# Altium project CB3-ECB.PrjPcb (part 1 of 3)
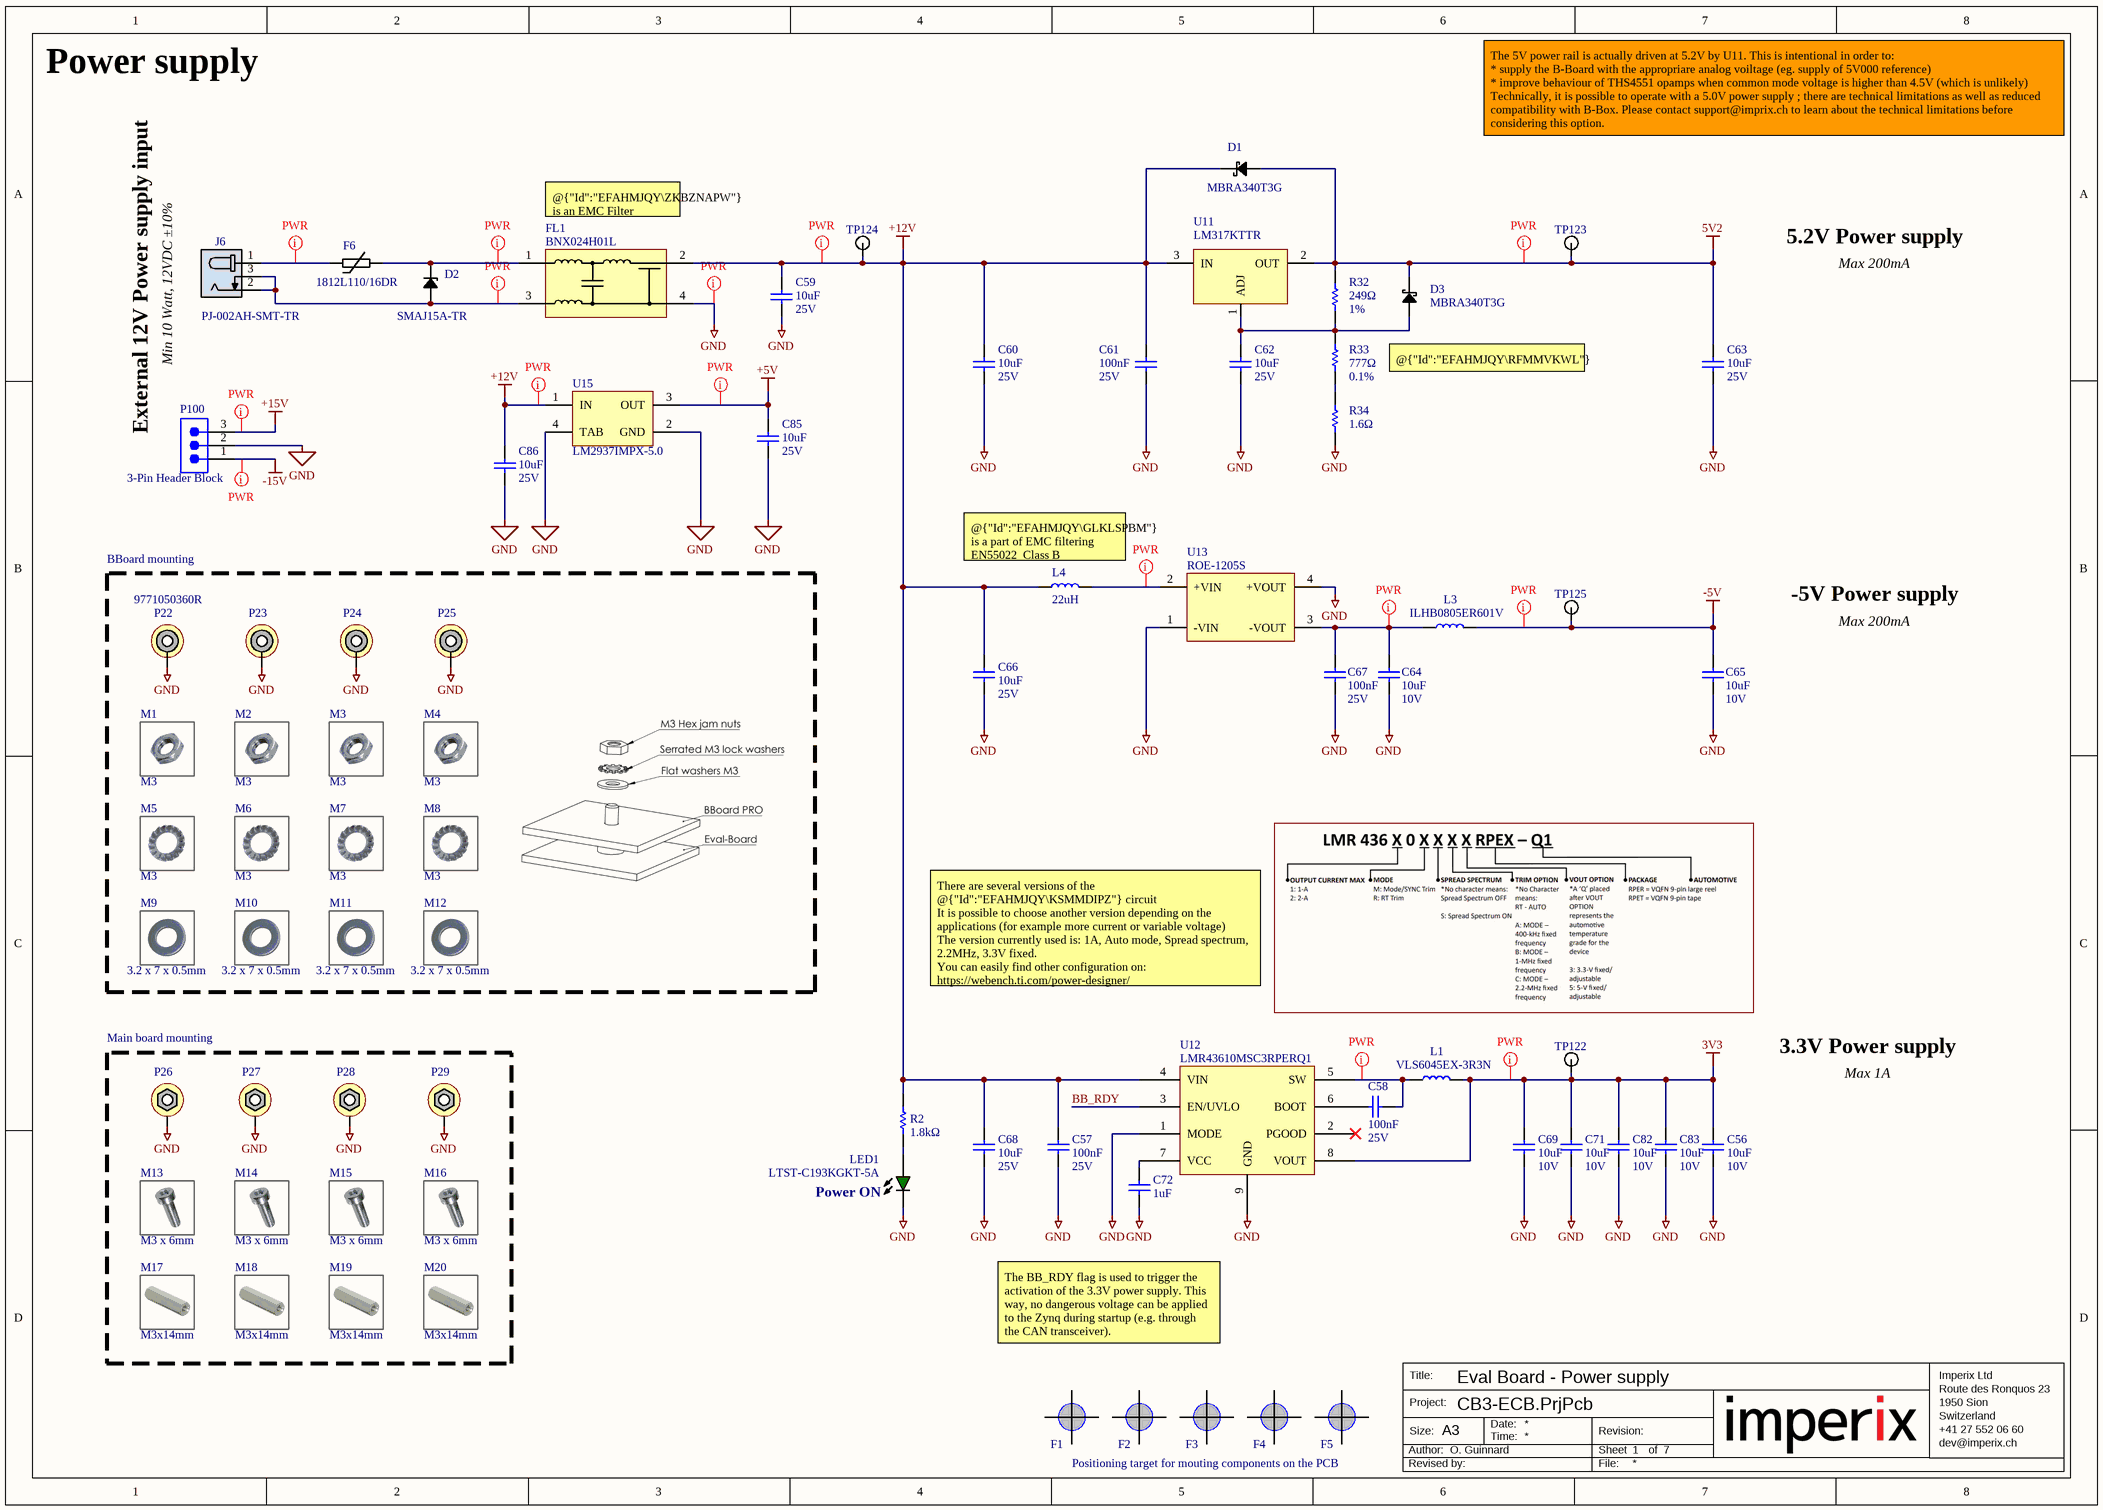
[diagram p0: Power.SchDoc]
ApprovedName: Nicolas Cherix; RevisionLetter: C; RevisionNumber: 1
6 sheets, 372 parts. Net scope: global (net labels, ports and power ports of the same name join across sheets).
Board files: CB3-ECB_PCB.PcbDoc, CB3_ECB_PCB_Pannelized.PcbDoc
Sheets:
  Power.SchDoc
  DAC.SchDoc
  ADC.SchDoc
  BBoard-JX1.SchDoc
  BBoard-JX2.SchDoc
  Test points.SchDoc

## Sheet Power.SchDoc: Eval Board - Power supply
size A3; ApprovedBy: Nicolas Cherix; Author: O. Guinnard; Organization: imperix Ltd; Address1: Rue de l'Industrie 10; Address2: 1950 Sion; Address3: Switzerland; Address4: +41 27 552 06 60; DocumentNumber: 1; Revision: C1; SheetNumber: 1; SheetTotal: 7

### Parts
C56  value 10uF  Voltage Rating (DC): 10V  [CAPC1608L(0603)]  (hidden comment: CAP-10UF-10V-X5R-0603-10%)
C57  value 100nF  Voltage Rating (DC): 25V  [CAPC1005L(0402)]  (hidden comment: CAP-100NF-25V-X7R-0402-10%)
C58  value 100nF  Voltage Rating (DC): 25V  [CAPC1005L(0402)]  (hidden comment: CAP-100NF-25V-X7R-0402-10%)
C59  value 10uF  Voltage Rating (DC): 25V  [CAPC3216L(1206)]  (hidden comment: CAP-10UF-25V-X5R-1206-10%)
C60  value 10uF  Voltage Rating (DC): 25V  [CAPC3216L(1206)]  (hidden comment: CAP-10UF-25V-X5R-1206-10%)
C61  value 100nF  Voltage Rating (DC): 25V  [CAPC1005L(0402)]  (hidden comment: CAP-100NF-25V-X7R-0402-10%)
C62  value 10uF  Voltage Rating (DC): 25V  [CAPC3216L(1206)]  (hidden comment: CAP-10UF-25V-X5R-1206-10%)
C63  value 10uF  Voltage Rating (DC): 25V  [CAPC3216L(1206)]  (hidden comment: CAP-10UF-25V-X5R-1206-10%)
C64  value 10uF  Voltage Rating (DC): 10V  [CAPC1608L(0603)]  (hidden comment: CAP-10UF-10V-X5R-0603-10%)
C65  value 10uF  Voltage Rating (DC): 10V  [CAPC1608L(0603)]  (hidden comment: CAP-10UF-10V-X5R-0603-10%)
C66  value 10uF  Voltage Rating (DC): 25V  [CAPC3216L(1206)]  (hidden comment: CAP-10UF-25V-X5R-1206-10%)
C67  value 100nF  Voltage Rating (DC): 25V  [CAPC1005L(0402)]  (hidden comment: CAP-100NF-25V-X7R-0402-10%)
C68  value 10uF  Voltage Rating (DC): 25V  [CAPC3216L(1206)]  (hidden comment: CAP-10UF-25V-X5R-1206-10%)
C69  value 10uF  Voltage Rating (DC): 10V  [CAPC1608L(0603)]  (hidden comment: CAP-10UF-10V-X5R-0603-10%)
C71  value 10uF  Voltage Rating (DC): 10V  [CAPC1608L(0603)]  (hidden comment: CAP-10UF-10V-X5R-0603-10%)
C72  value 1uF  [CAPC1005L(0402)]  (hidden comment: CAP-1UF-6.3V-X5R-0402-5%)
C82  value 10uF  Voltage Rating (DC): 10V  [CAPC1608L(0603)]  (hidden comment: CAP-10UF-10V-X5R-0603-10%)
C83  value 10uF  Voltage Rating (DC): 10V  [CAPC1608L(0603)]  (hidden comment: CAP-10UF-10V-X5R-0603-10%)
C85  value 10uF  Voltage Rating (DC): 25V  [CAPC3216L(1206)]  (hidden comment: CAP-10UF-25V-X5R-1206-10%)
C86  value 10uF  Voltage Rating (DC): 25V  [CAPC3216L(1206)]  (hidden comment: CAP-10UF-25V-X5R-1206-10%)
D1  MBRA340T3G  [DO-214AC]
D2  SMAJ15A-TR  [DO-214AC]
D3  MBRA340T3G  [DO-214AC]
F1  Fiducial  [Fiducial050]  (value not drawn)  (no BOM)
F2  Fiducial  [Fiducial050]  (value not drawn)  (no BOM)
F3  Fiducial  [Fiducial050]  (value not drawn)  (no BOM)
F4  Fiducial  [Fiducial050]  (value not drawn)  (no BOM)
F5  Fiducial  [Fiducial050]  (value not drawn)  (no BOM)
F6  1812L110/16DR  [PTC Fuse(1812)]
FL1  BNX024H01L  [FP-BNX02-MFG]
J6  PJ-002AH-SMT-TR  [PJ-002AH-SMT-TR]
L1  VLS6045EX-3R3N  [VLS6045EX]
L3  ILHB0805ER601V  [RESC2012L(0805)]
L4  value 22uH  [Inductor 8400 Serie]  (hidden comment: 84223C)
LED1  LTST-C193KGKT-5A  [LED0603_GREEN]
M1  value M3  (hidden comment: 1090615)  (mechanical)
M2  value M3  (hidden comment: 1090615)  (mechanical)
M3  value M3  (hidden comment: 1090615)  (mechanical)
M4  value M3  (hidden comment: 1090615)  (mechanical)
M5  value M3  (hidden comment: 1278037)  (mechanical)
M6  value M3  (hidden comment: 1278037)  (mechanical)
M7  value M3  (hidden comment: 1278037)  (mechanical)
M8  value M3  (hidden comment: 1278037)  (mechanical)
M9  value 3.2 x 7 x 0.5mm  (hidden comment: 1887467)  (mechanical)
M10  value 3.2 x 7 x 0.5mm  (hidden comment: 1887467)  (mechanical)
M11  value 3.2 x 7 x 0.5mm  (hidden comment: 1887467)  (mechanical)
M12  value 3.2 x 7 x 0.5mm  (hidden comment: 1887467)  (mechanical)
M13  value M3 x 6mm  (hidden comment: 1145924)  (mechanical)
M14  value M3 x 6mm  (hidden comment: 1145924)  (mechanical)
M15  value M3 x 6mm  (hidden comment: 1145924)  (mechanical)
M16  value M3 x 6mm  (hidden comment: 1145924)  (mechanical)
M17  value M3x14mm  (hidden comment: 1382748)  (mechanical)
M18  value M3x14mm  (hidden comment: 1382748)  (mechanical)
M19  value M3x14mm  (hidden comment: 1382748)  (mechanical)
M20  value M3x14mm  (hidden comment: 1382748)  (mechanical)
P22  9771050360R  [9771050360R]
P23  9771050360R  [9771050360R]  (value not drawn)
P24  9771050360R  [9771050360R]  (value not drawn)
P25  9771050360R  [9771050360R]  (value not drawn)
P26  Spacer M3 connected  [Spacer M3 connected]  (value not drawn)  (no BOM)
P27  Spacer M3 connected  [Spacer M3 connected]  (value not drawn)  (no BOM)
P28  Spacer M3 connected  [Spacer M3 connected]  (value not drawn)  (no BOM)
P29  Spacer M3 connected  [Spacer M3 connected]  (value not drawn)  (no BOM)
P100  3-Pin Header Block  [691322310003]
R2  value 1.8kΩ  [RESC1608L(0603)]  (hidden comment: RES-1.8KΩ-1/8W-25PPM-0603-0.1%)
R32  value 249Ω  Tolerance: 1%  [RESC1005L(0402)]  (hidden comment: RES-249Ω-1/16W-100PPM-0402-1%)
R33  value 777Ω  Tolerance: 0.1%  [RESC1005L(0402)]  (hidden comment: RES-777Ω-1/16W-25PPM-0402-0.1%)
R34  value 1.6Ω  [RESC1005L(0402)]  (hidden comment: RES-1.6Ω-1/16WW-200PPM-0402-5%)
TP122  5001  [5001]  (value not drawn)
TP123  5001  [5001]  (value not drawn)
TP124  5001  [5001]  (value not drawn)
TP125  5001  [5001]  (value not drawn)
U11  LM317KTTR  [TO263-3]
U12  LMR43610MSC3RPERQ1  [LMR43610MSC3RPERQ1]
U13  ROE-1205S  [ROE]
U15  LM2937IMPX-5.0  [MP04A_M]

### Blocks framed on the sheet
BBoard mounting: M1-M12 P22-P25
Main board mounting: M13-M20 P26-P29

### Nets
3V3: C56.2 C69.2 C71.2 C82.2 C83.2 L1.2 TP122.1(TP) U12.8(VOUT)
5V2: C63.2 D1.A D3.K R32.2 TP123.1(TP) U11.2(OUT)
+5V: C85.2 U15.3(OUT)
+12V: C57.2 C59.2 C60.2 C61.2 C66.2 C68.2 C86.2 D1.K FL1.2(CB) L4.1 R2.2 TP124.1(TP) U11.3(IN) U12.4(VIN) U15.1(IN)
+15V: P100.3
-5V: C65.1 L3.2 TP125.1(TP)
-15V: P100.1
GND: C56.1 C57.1 C59.1 C60.1 C61.1 C62.1 C63.1 C64.2 C65.2 C66.1 C67.2 C68.1 C69.1 C71.1 C72.1 C82.1 C83.1 C85.1 C86.1 FL1.4(CG) LED1.K P22.0 P23.0 P24.0 P25.0 P26.1 P27.1 P28.1 P29.1 P100.2 R34.1 U12.1(MODE) U12.9(GND) U13.1(-VIN) U13.4(+VOUT) U15.2(GND) U15.4(TAB)
BB_RDY: U12.3(EN/UVLO)
NetC58_1: C58.1 L1.1 U12.5(SW)
NetC58_2: C58.2 U12.6(BOOT)
NetC62_2: C62.2 D3.A R32.1 R33.2 U11.1(ADJ)
NetC64_1: C64.1 C67.1 L3.1 U13.3(-VOUT)
NetC72_2: C72.2 U12.7(VCC)
NetD2_A: D2.A FL1.3(PSG) J6.2 J6.3
NetD2_K: D2.K F6.2 FL1.1(B)
NetF6_1: F6.1 J6.1
NetL4_2: L4.2 U13.2(+VIN)
NetLED1_A: LED1.A R2.1
NetR33_1: R33.1 R34.2

Not connected (* = marked no-connect by the designer): U12 2(PGOOD)*

### Layout directives
net class PWR: 3V3, 5V2, +5V, +12V, +15V, -5V, -15V, GND, NetC58_1, NetC64_1, NetD2_A, NetD2_K, NetF6_1, NetL4_2

### Notes on the sheet
- Power supply
- The 5V power rail is actually driven at 5.2V by U11. This is intentional in order to:
  * supply the B-Board with the appropriare analog voiltage (eg. supply of 5V000 reference)
  * improve behaviour of THS4551 opamps when common mode voltage is higher than 4.5V (which is unlikely)
  Technically, it is possible to operate with a 5.0V power supply ; there are technical limitations as well as reduced compatibility with B-Box. Please contact support@imprix.ch to learn about the technical limitations before considering this option.
- (near FL1) @{"Id":"EFAHMJQY\ZKBZNAPW"} is an EMC Filter
- 5.2V Power supply
- External 12V Power supply input
- Min 10 Watt, 12VDC ±10%
- Max 200mA
- @{"Id":"EFAHMJQY\RFMMVKWL"} helps reduce the noise of @{"Id":"EFAHMJQY\SLPSMMLY"}
- (near L4) @{"Id":"EFAHMJQY\GLKLSPBM"} is a part of EMC filtering
  EN55022  Class B
- -5V Power supply
- There are several versions of the @{"Id":"EFAHMJQY\KSMMDIPZ"} circuit
  It is possible to choose another version depending on the applications (for example more current or variable voltage)
  The version currently used is: 1A, Auto mode, Spread spectrum, 2.2MHz, 3.3V fixed.
  You can easily find other configuration on: https://webench.ti.com/power-designer/
- 3.3V Power supply
- Max 1A
- (near LED1) Power ON
- The BB_RDY flag is used to trigger the activation of the 3.3V power supply. This way, no dangerous voltage can be applied to the Zynq during startup (e.g. through the CAN transceiver).
- Positioning target for mouting components on the PCB
- Title:
- Imperix Ltd
- Route des Ronquos 23
- Author:
- Project:
- Size:
- A3
- Date:
- Time:
- Revision:
- Sheet
- of
- 1950 Sion
- Switzerland
- +41 27 552 06 60
- dev@imperix.ch
- Revised by:
- File:

### Library data of the parts
C56 C64 C65 C69 C71 C82 C83 = CMP-055-000003-7: CAP CER 10UF 10V X5R 0603 10% (Generic Imperix Component); Tolerance: 10%; Dielectric: X5R; Case/Package: 0603
C57 C58 C61 C67 = CMP-004-000006-18: CAP CER 100NF 25V X7R 0402 10% (Generic Imperix Component); Tolerance: 10%; Case/Package: 0402; Dielectric: X7R
C59 C60 C62 C63 C66 C68 C85 C86 = CMP-002-000022-5: CAP CER 10UF 25V X5R 1206 10% (Generic Imperix Component); Tolerance: 10%; Dielectric: X5R; Case/Package: 1206
  C86: Manufacturer: *
C72 = CMP-004-000008-13: CAP CER 1UF 6.3V X5R 0402 5% (Generic Imperix Component); Tolerance: 5%; Case/Package: 0402; Dielectric: X5R; Voltage Rating (DC): 6.3V
D1 D3 = CMP-005-000028-6: Diode Schottky 40 V 3A Surface Mount SMA; Max Forward Surge Current (Ifsm): 100A; Max Repetitive Reverse Voltage (Vrrm): 40V; Polarity: Standard; Element Configuration: Single; Forward Voltage: 450mV; Max Reverse Current: 300uA; Max Operating Temperature: 150°C; Radiation Hardening: No; Length: 4.32mm; Reach SVHC Compliant: No; Pins: 2; Package Quantity: 1; Voltage Rating (DC): 40V; RoHS Compliant: Yes; Halogen Free: Halogen Free; Series: -; Current Rating: 3A; Case/Package: DO-214AC; Height: 2mm; Min Operating Temperature: -55°C; Lead Free: Lead Free; Peak Non-Repetitive Surge Current: 100A; Max Reverse Voltage (DC): 40V; Output Current: 3A; Width: 2.6mm; Packaging: Tape and Reel; Forward Current: 3A; Average Rectified Current: 3A
D2 = CMP-030-000001-20: 32.5V Clamp 71A (8/20µs) Ipp Tvs Diode Surface Mount SMA (DO-214AC) Unidirectional; Voltage Rating (DC): 15V; Leakage Current: 200nA; Max Breakdown Voltage: 17.6V; Value: 975pF; Min Breakdown Voltage: 16.7V; Number of Elements: 1; Diode Type: ZENER; Power Line Protection: No; Power Dissipation: 400W; ESD Protection: Yes; Test Current: 1mA; Min Operating Temperature: -55°C; Height: 2.03mm; Max Reverse Leakage Current: 200nA; Breakdown Voltage: 17.6V; Max Operating Temperature: 150°C; Clamping Voltage-Max: 32.5V; Lead Free: Lead Free; Clamping Voltage: 32.5V; Polarity: Unidirectional; Reach SVHC Compliant: No; Width: 4.6mm; RoHS Compliant: Yes; Radiation Hardening: No; Case/Package: DO-214AC; Mounting Technology: Surface Mount; Direction: Unidirectional; Pins: 2; Package Quantity: 1; Peak Pulse Power: 400W; Series: SMAJ, TRANSIL™; Reverse Breakdown Voltage: 16.7V; Reverse Standoff Voltage: 15V; Operating Supply Voltage: 15V; Length: 2.95mm; Max Surge Current: 1mA; Packaging: Tape and Reel; Peak Pulse Current: 71A; Number of Unidirectional Channels: 1; Termination: SMD/SMT
F1-F5 = CMP-031-000000-13: Fiducial for pick&place (No BOM)
F6 = CMP-00170-3: PTC Resettable Fuse 1.1A(hold)  1.95A(trip) 16VDC 1812; Max Voltage Rating (DC): 16V; Approvals: cULus,TUV; Value: 180mR; Max Power Dissipation: 800mW; Max Current Rating: 100A; Time to Trip: 300ms; Hold Current: 1.1A; Width: 4.73mm; Max Operating Temperature: 85°C; Trip Current: 1.95A; Case Code (Metric): 4532; Mounting Technology: Surface Mount; Packaging: Tape and Reel; Case Code (Imperial): 1812; RoHS Compliant: Yes; Case/Package: 1812; Series: 1812L; Power Dissipation: 800mW; Package Quantity: 1500; Current Rating: 100A; Lead Free: Lead Free; Termination: SMD/SMT; Operating Supply Voltage: 16V; Min Operating Temperature: -40°C; Voltage Rating (DC): 16V; Reach SVHC Compliant: Unknown; Working Voltage: 16V
FL1 = CMP-00068-6: EMI Filter Block 15A 50VDC Flat Style SMD Automotive Embossed T/R
J6 = CMP-056-000006-11: 2.0 x 6.5 mm, 5.0 A, Horizontal, Surface Mount (SMT), Dc Power Jack Connector; Body Color: Black; Gender: Male; Shielding: Unshielded; Connector Type: Jack; Contact Material: Brass; Contact Plating: Nickel; Flammability Rating: UL94 V-0; Housing Material: Nylon; Max Operating Temperature: 85°C; Min Operating Temperature: -25°C; Mounting Technology: Surface Mount; Termination: Solder
L1 = CMP-259-000003-2: Inductor Power Shielded Wirewound 3.3uH 30% 100KHz Ferrite 4.95A 0.0299Ohm DCR 2424 T/R; DC Resistance (DCR): 30mR; Saturation Current: 6.5A; Shielding: Shielded; Mounting Technology: Surface Mount; Core Material: Ferrite; Length: 0.236inch; Current Rating: 4.95A; Test Frequency: 100kHz; Height - Seated (Max): 0.177inch; Inductance Tolerance: 30%; RMS Current (Irms): 4.95A; Reach SVHC Compliant: No; Tolerance: 30%; Case/Package: Nonstandard; Width: 0.236inch; RoHS Compliant: Yes; Packaging: Cut Tape; Value: 3.3uH; Series: VLS-EX; Max Operating Temperature: 105°C; Min Operating Temperature: -40°C
L3 = CMP-007-000004-5: Ferrite Beads Multi-Layer High Current 600Ohm 25% 100MHz 2A 100mOhm DCR 0805 T/R; DC Resistance (DCR): 100mR; Impedance: 600R; Number of Lines: 1; Shielding: Shielded; Value: 600Ω 2A; Case/Package: 0805; Case Code (Imperial): 0805; Case Code (Metric): 2012; Core Material: Ferrite; Current Rating: 2A; DC Current: 2A; Depth: 1.45mm; Height: 0.043inch; Lead Free: Lead Free; Length: 0.079inch; Max Current Rating: 2A; Max DC Current: 2A; Max Operating Temperature: 125°C; Military Standard: Not; Min Operating Temperature: -55°C; Mounting Technology: Surface Mount; Package Quantity: 4000; Packaging: Tape and Reel; Pins: 2; Radiation Hardening: No; Reach SVHC Compliant: Unknown; RoHS Compliant: Yes; Self Resonant Frequency: 100MHz; Series: ILHB; Termination: SMD/SMT; Test Frequency: 100MHz; Tolerance: 25%; Width: 1.25mm
L4 = CMP-00092-4: Inductor Power Wirewound 22uH 10% 0.6A 0.6Ohm DCR 1812; Shielding: Unshielded; DC Resistance (DCR): 600mR; Max DC Current: 600mA; Min Operating Temperature: -40°C; Depth: 3.6mm; Termination: SMD/SMT; Packaging: Tape and Reel; Case/Package: Nonstandard; Max Operating Temperature: 125°C; Width: 3.3mm; Length: 4.5mm; Height: 2.6mm; Series: 8400; Mounting Technology: Surface Mount; RoHS Compliant: Yes; Tolerance: 10%; Radiation Hardening: No
LED1 = CMP-030-000000-10: LED GREEN CLEAR 0603 SMD; Lens Size: 0.8mm; Lens Color: Colorless; Illumination Color: Green,Yellow; Dominant Wavelength: 576.5nm; Test Current: 5mA; Luminous Intensity: 28mcd; Power Dissipation: 75mW; Lens Style: Flat,Diffused,Colorless,Rectangular,Clear; Forward Voltage: 2.3V; Reverse Voltage: 5V; Viewing Angle: 130°; Number of Elements: 1; Forward Current: 30mA; Radiation Hardening: No; RoHS Compliant: Yes; Series: -; Case/Package: 0603; Depth: 0.8mm; Min Operating Temperature: -55°C; Height: 0.45mm; Mounting Technology: Surface Mount; Lens Transparency: Clear; Case Code (Metric): 1608; Pins: 2; Lead Free: Lead Free; Color: Green; Power Rating: 75mW; Packaging: Tape and Reel; Case Code (Imperial): 0603; Package Quantity: 3000; Max Operating Temperature: 85°C; Length: 1.6mm; Number of LEDs: 1; Width: 0.8mm
M1-M4 = CMP-00174-1: M3 Hex jam nuts; Thread size: M3; Thickness: 1.8mm
M5-M8 = CMP-00031-5: Serrated M3 lock washers type A, external serrations
M9-M12 = CMP-00030-4: Flat washers M3 without chamfer
M13-M16 = CMP-00026-4: Hexalobular (6 Lobe) socket head cap M3x6mm screws with low head, fully threaded; Thread size: M3; Length: 6mm
M17-M20 = CMP-00173-1: Brass Spacer M3x14mm  Metric Thread int./int.; Plating: Nickel; Gender: Female, Female; Threaded/Unthreaded: Threaded; Color: Silver; Material: Brass
P22-P25 = CMP-002-000068-13: WA-SMSE SMT Steel Spacer, M3x5mm Thread External; Thread Size: M3; Threaded/Unthreaded: Threaded; Outside Diameter: 0.236inch; Plating: Tin; Body Length: 5mm; Mounting Technology: External; Length: 0.433inch; Material: Steel; Series: WA-SMSE; Reach SVHC Compliant: Unknown; Width: 6mm
P26-P29 = CMP-00128-10: Hole and pad for spacer M3; Outside diameter SW: 5.5mm; Thread Size: M3
P100 = CMP-1502-01887-2: TERM BLOCK HDR 3POS 90DEG 3.81MM; NexarPartId: 8917778; Manufacturer: Würth; Number of Positions Per Level: 3; Current: 10A; Voltage: 300V; Number of Levels: 1; Gender: Male; Termination: Solder; Number of Rows: 1; Contact Plating: Tin; Packaging: Box; Height: 9.2mm; Pitch: 3.81mm; Mount: Through Hole; Number of Contacts: 3; Width: 12.82mm; Lead Pitch: 3.81mm; REACH SVHC: Unknown; RoHS: Compliant; Length: 10.5mm; Number of Pins: 3; Color: Green; Contact Material: Brass; Manufacturer Part Number: 691322310003; Distributor Link: https://www.digikey.de/de/products/detail/w%C3%BCrth-elektronik/691322310003/2060585
R2 = CMP-00098-1: RES SMD 1.8KΩ 1/8W 25PPM 0603 0.1% (Generic Imperix Component); Temperature Coefficient: 25ppm/°C; Tolerance: 0.1%; Power Rating: 1/8W; Case/Package: 0603
R32 = CMP-132-000003-2: RES SMD 249Ω 1/16W 100PPM 0402 1% (Generic Imperix Component); Temperature Coefficient: 100ppm/°C; Power Rating: 1/16W; Case/Package: 0402
R33 = CMP-150-000004-2: RES SMD 777Ω 1/16W 25PPM 0402 0.1% (Generic Imperix Component); Temperature Coefficient: 25ppm/°C; Power Rating: 1/16W; Case/Package: 0402
R34 = CMP-004-000018-3: RES SMD 1.6Ω 1/16WW 200PPM 0402 5% (Generic Imperix Component); Temperature Coefficient: 200ppm/°C; Power Rating: 1/16W; Tolerance: 5%; Case/Package: 0402
TP122-TP125 = CMP-049-000000-14: Black PC Test Point, Miniature Phosphor Bronze Silver Plating Through Hole Mounting Type; Inside Diameter: 1.27mm; Hole Diameter: 1.6mm; Outside Diameter: 2.54mm; Number of Contacts: 1; Insulation: Insulated; Contact Material: Bronze; Material: Nylon,Bronze,Silver; Mounting Technology: Through Hole; Series: THM; Reach SVHC Compliant: No; Length: 7.62mm; Body Material: Bronze; Lead Free: Lead Free; Packaging: Bulk; Package Quantity: 100; Contact Plating: Tin,Silver; Color: Black; RoHS Compliant: Yes; Insulation Material: Nylon; Housing Color: Black; Orientation: Straight; Diameter: 2.54mm; Termination: Through Hole; Number of Ports: 1; Plating: Silver
U11 = CMP-011-000003-10: IC REG LINEAR ADJ 1.5A DDPAK; Number of Regulators: 1; Dropout Voltage: 2V; Polarity: Positive; Output Type: Adjustable; Quiescent Current: 3.5mA; Max Supply Voltage: 40V; Power Supply Rejection Ratio (PSRR): 64dB; Min Output Voltage: 1.25V; Reference Voltage: 1.3V; Output Voltage: 37V; Min Input Voltage: 4.2V; Length: 10.18mm; Pins: 3; Output Current: 1.5A; Max Operating Temperature: 125°C; Package Quantity: 1; Mounting Technology: Surface Mount; Packaging: Tape and Reel; Series: LM317; Min Operating Temperature: 0°C; Reach SVHC Compliant: No; Max Output current: 1.5A; Weight: 0.050897oz; Number of Outputs: 1; Width: 8.41mm; Lead Free: Lead Free; Case/Package: TO263-3; Max Output Voltage: 37V; Height: 4.44mm; RoHS Compliant: Yes
U12 = CMP-00162-5: LMR436x0, 36-V, 1-A Buck Converter
U13 = CMP-004-000025-11: Isolated Module DC DC Converter 1 Output 5V 200mA 10.8V - 13.2V Input; Isolation Voltage: 1kV; Efficiency: 80%; Number of Outputs: 1; Max Power Dissipation: 1W; Max Output current: 200mA; Series: ECONOLINE ROE (E-Series) (1W); RoHS Compliant: Yes; Max Operating Temperature: 85°C; Packaging: Rail/Tube; Voltage - Output 1: 5V; Min Input Voltage: 10.8V; Length: 11.5mm; Max Output Voltage: 5V; Min Operating Temperature: -40°C; Max Supply Voltage: 13.2V; Width: 6mm; Height: 10mm; Mounting Technology: Through Hole; Lead Free: Lead Free; Weight: 1.4g
U15 = CMP-001-0000-1: IC REG LINEAR 5V 400MA SOT223-4

## Sheet DAC.SchDoc: Eval Board -  Analog outputs
size A3; ApprovedBy: Nicolas Cherix; Author: O. Guinnard; Organization: imperix Ltd; Address1: Rue de l'Industrie 10; Address2: 1950 Sion; Address3: Switzerland; Address4: +41 27 552 06 60; DocumentNumber: 2; Revision: C1; SheetNumber: 2; SheetTotal: 7
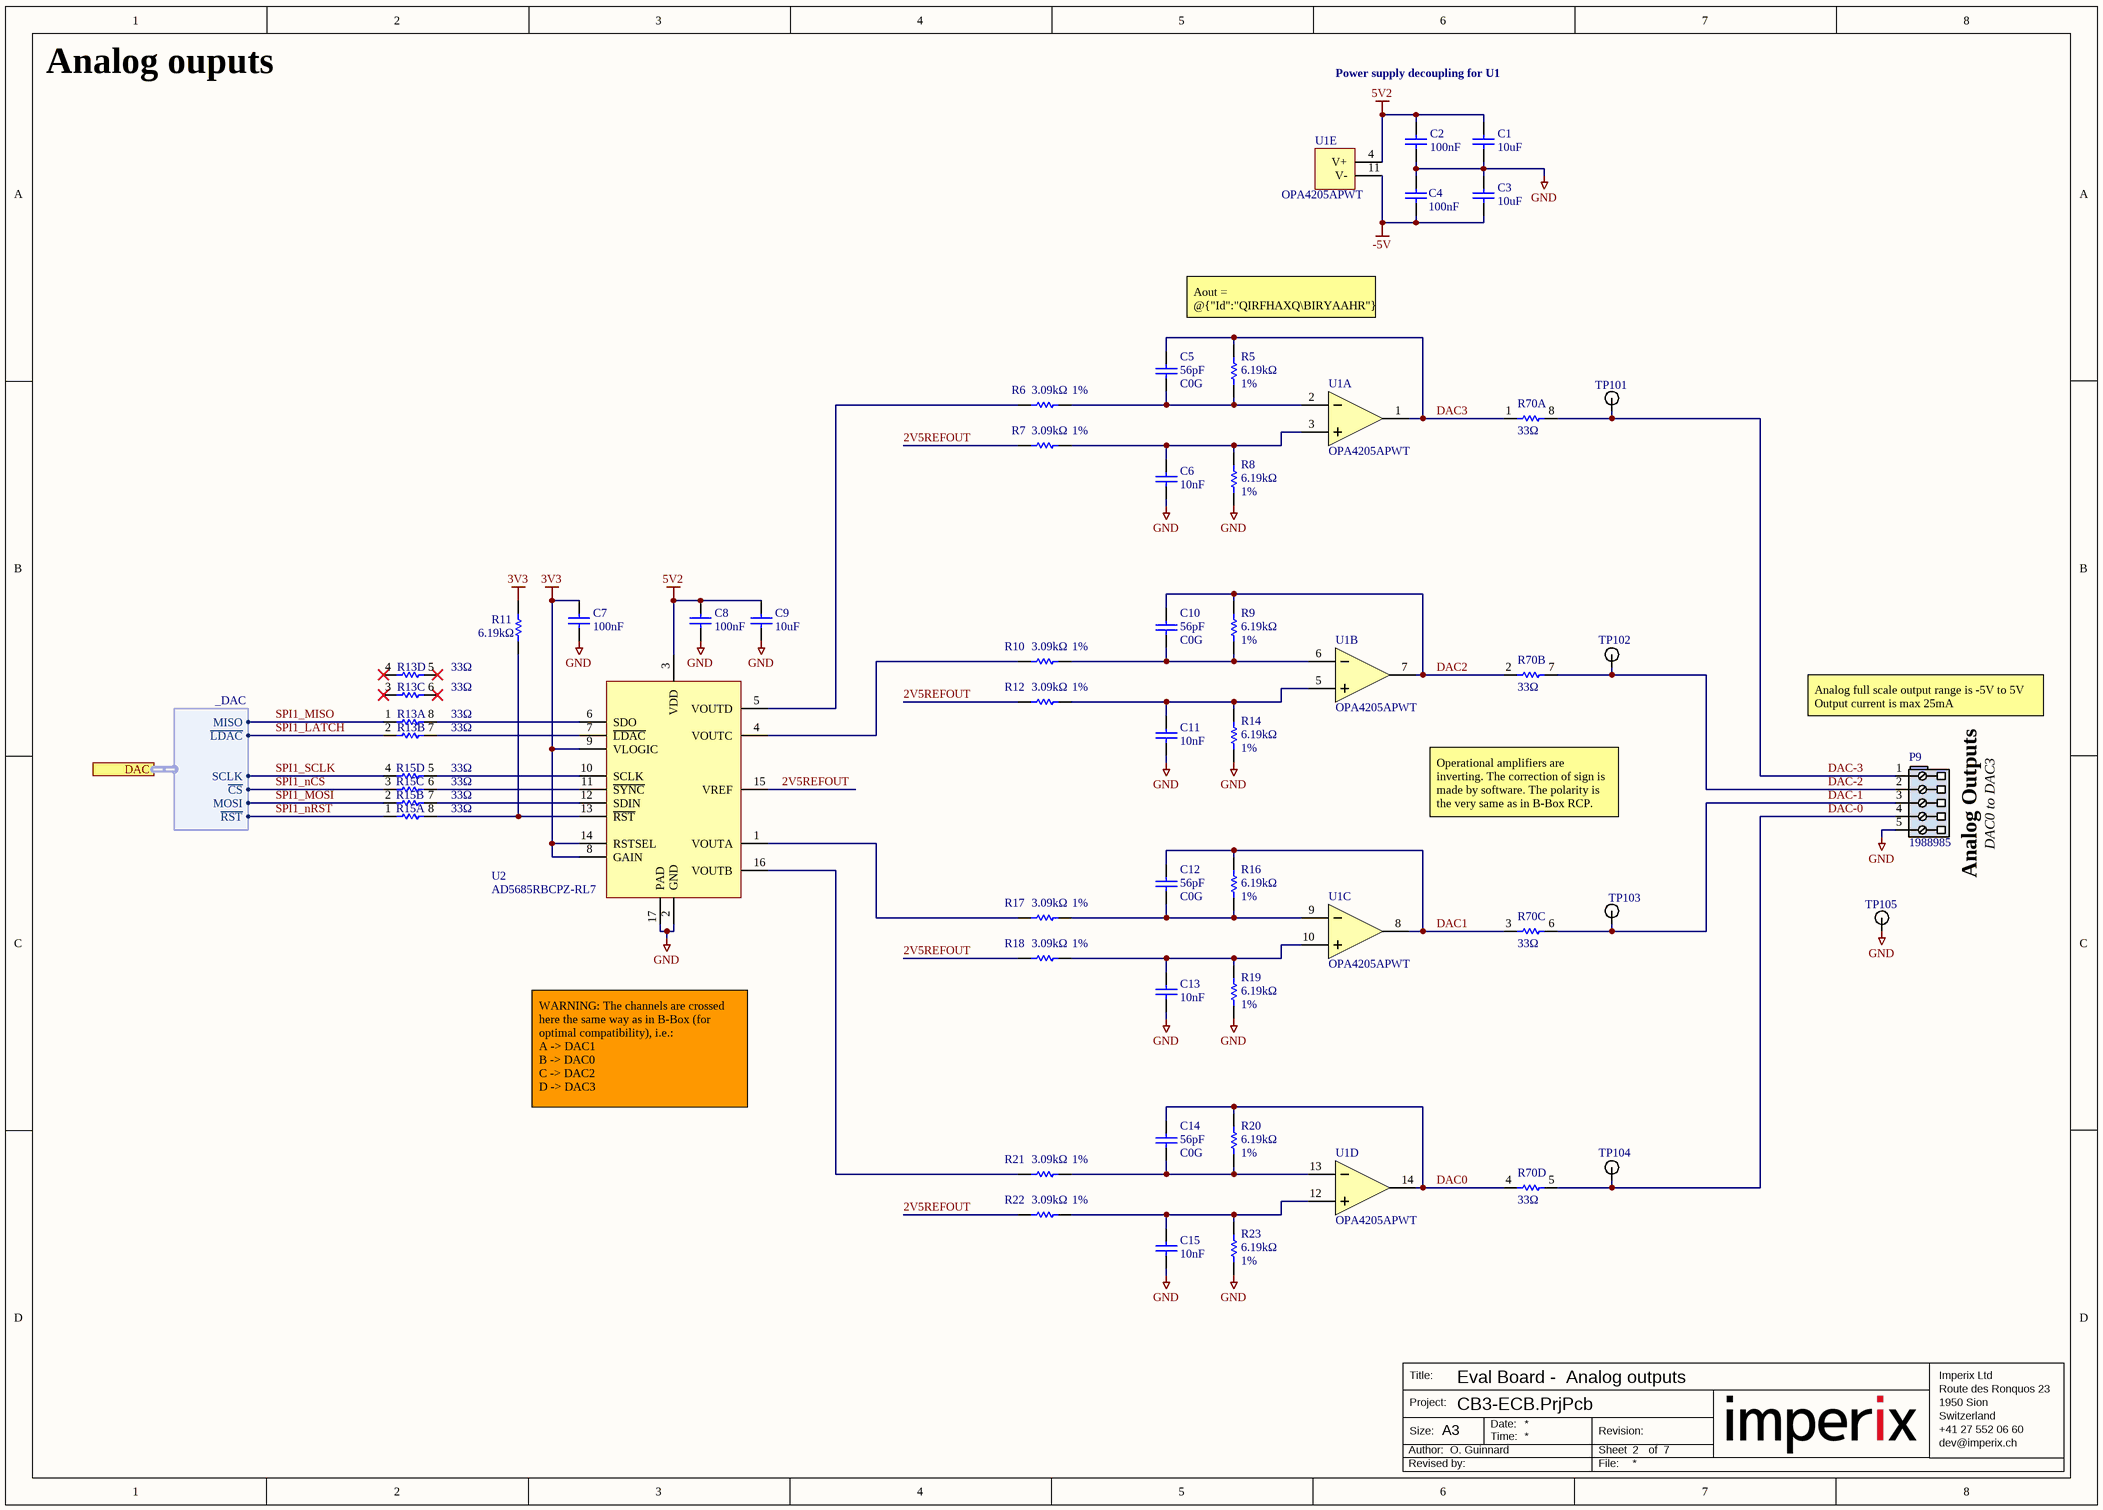
[diagram p1: DAC.SchDoc]

### Parts
C1  value 10uF  [CAPC1608L(0603)]  (hidden comment: CAP-10UF-10V-X5R-0603-10%)
C2  value 100nF  [CAPC1005L(0402)]  (hidden comment: CAP-100NF-25V-X7R-0402-10%)
C3  value 10uF  [CAPC1608L(0603)]  (hidden comment: CAP-10UF-10V-X5R-0603-10%)
C4  value 100nF  [CAPC1005L(0402)]  (hidden comment: CAP-100NF-25V-X7R-0402-10%)
C5  value 56pF  Dielectric: C0G  [CAPC1005L(0402)]  (hidden comment: CAP-56PF-50V-C0G-0402-1%)
C6  value 10nF  [CAPC1005L(0402)]  (hidden comment: CAP-10NF-25V-X7R-0402-10%)
C7  value 100nF  [CAPC1005L(0402)]  (hidden comment: CAP-100NF-25V-X7R-0402-10%)
C8  value 100nF  [CAPC1005L(0402)]  (hidden comment: CAP-100NF-25V-X7R-0402-10%)
C9  value 10uF  [CAPC1608L(0603)]  (hidden comment: CAP-10UF-10V-X5R-0603-10%)
C10  value 56pF  Dielectric: C0G  [CAPC1005L(0402)]  (hidden comment: CAP-56PF-50V-C0G-0402-1%)
C11  value 10nF  [CAPC1005L(0402)]  (hidden comment: CAP-10NF-25V-X7R-0402-10%)
C12  value 56pF  Dielectric: C0G  [CAPC1005L(0402)]  (hidden comment: CAP-56PF-50V-C0G-0402-1%)
C13  value 10nF  [CAPC1005L(0402)]  (hidden comment: CAP-10NF-25V-X7R-0402-10%)
C14  value 56pF  Dielectric: C0G  [CAPC1005L(0402)]  (hidden comment: CAP-56PF-50V-C0G-0402-1%)
C15  value 10nF  [CAPC1005L(0402)]  (hidden comment: CAP-10NF-25V-X7R-0402-10%)
P9  1988985  [1988985]
R5  value 6.19kΩ  Tolerance: 1%  [RESC1005L(0402)]  (hidden comment: RES-6.19KΩ-1/16W-100PPM-0402-1%)
R6  value 3.09kΩ  Tolerance: 1%  [RESC1005L(0402)]  (hidden comment: RES-3.09KΩ-1/16W-100PPM-0402-1%)
R7  value 3.09kΩ  Tolerance: 1%  [RESC1005L(0402)]  (hidden comment: RES-3.09KΩ-1/16W-100PPM-0402-1%)
R8  value 6.19kΩ  Tolerance: 1%  [RESC1005L(0402)]  (hidden comment: RES-6.19KΩ-1/16W-100PPM-0402-1%)
R9  value 6.19kΩ  Tolerance: 1%  [RESC1005L(0402)]  (hidden comment: RES-6.19KΩ-1/16W-100PPM-0402-1%)
R10  value 3.09kΩ  Tolerance: 1%  [RESC1005L(0402)]  (hidden comment: RES-3.09KΩ-1/16W-100PPM-0402-1%)
R11  value 6.19kΩ  [RESC1005L(0402)]  (hidden comment: RES-6.19KΩ-1/16W-100PPM-0402-1%)
R12  value 3.09kΩ  Tolerance: 1%  [RESC1005L(0402)]  (hidden comment: RES-3.09KΩ-1/16W-100PPM-0402-1%)
R13  value 33Ω  [RESQUAD0804]  (hidden comment: EXB-28V330JX)  (parts A,B,C,D of 4)
R14  value 6.19kΩ  Tolerance: 1%  [RESC1005L(0402)]  (hidden comment: RES-6.19KΩ-1/16W-100PPM-0402-1%)
R15  value 33Ω  [RESQUAD0804]  (hidden comment: EXB-28V330JX)  (parts A,B,C,D of 4)
R16  value 6.19kΩ  Tolerance: 1%  [RESC1005L(0402)]  (hidden comment: RES-6.19KΩ-1/16W-100PPM-0402-1%)
R17  value 3.09kΩ  Tolerance: 1%  [RESC1005L(0402)]  (hidden comment: RES-3.09KΩ-1/16W-100PPM-0402-1%)
R18  value 3.09kΩ  Tolerance: 1%  [RESC1005L(0402)]  (hidden comment: RES-3.09KΩ-1/16W-100PPM-0402-1%)
R19  value 6.19kΩ  Tolerance: 1%  [RESC1005L(0402)]  (hidden comment: RES-6.19KΩ-1/16W-100PPM-0402-1%)
R20  value 6.19kΩ  Tolerance: 1%  [RESC1005L(0402)]  (hidden comment: RES-6.19KΩ-1/16W-100PPM-0402-1%)
R21  value 3.09kΩ  Tolerance: 1%  [RESC1005L(0402)]  (hidden comment: RES-3.09KΩ-1/16W-100PPM-0402-1%)
R22  value 3.09kΩ  Tolerance: 1%  [RESC1005L(0402)]  (hidden comment: RES-3.09KΩ-1/16W-100PPM-0402-1%)
R23  value 6.19kΩ  Tolerance: 1%  [RESC1005L(0402)]  (hidden comment: RES-6.19KΩ-1/16W-100PPM-0402-1%)
R70  value 33Ω  [RESQUAD0804]  (hidden comment: EXB-28V330JX)  (parts A,B,C,D of 4)
TP101  5001  [5001]  (value not drawn)
TP102  5001  [5001]  (value not drawn)
TP103  5001  [5001]  (value not drawn)
TP104  5001  [5001]  (value not drawn)
TP105  5001  [5001]  (value not drawn)
U1  OPA4205APWT  [TSSOP65P640-14N]  (parts A,B,C,D,E of 5)
U2  AD5685RBCPZ-RL7  [QFN50P300X300-16WAL]

### Ports
DAC (harness _DAC)

### Harnesses
_DAC: MOSI, MISO, SCLK, ~{CS}, ~{LDAC}, ~{RST}

### Nets
3V3: C7.2 R11.2 U2.8(GAIN) U2.9(VLOGIC) U2.14(RSTSEL)
5V2: C1.2 C2.2 C8.2 C9.2 U1.4(V+) U2.3(VDD)
-5V: C3.1 C4.1 U1.11(V-)
GND: C1.1 C2.1 C3.2 C4.2 C6.1 C7.1 C8.1 C9.1 C11.1 C13.1 C15.1 P9.5 R8.1 R14.1 R19.1 R23.1 TP105.1(TP) U2.2(GND) U2.17(PAD)
2V5REFOUT: R7.2 R12.2 R18.2 R22.2 U2.15(VREF)
DAC0: C14.2 R20.2 R70.4 U1.14(OUT)
DAC1: C12.2 R16.2 R70.3 U1.8(OUT)
DAC2: C10.2 R9.2 R70.2 U1.7(OUT)
DAC3: C5.2 R5.2 R70.1 U1.1(OUT)
DAC-0: P9.4 R70.5 TP104.1(TP)
DAC-1: P9.3 R70.6 TP103.1(TP)
DAC-2: P9.2 R70.7 TP102.1(TP)
DAC-3: P9.1 R70.8 TP101.1(TP)
SPI1_LATCH: R13.2 ; port DAC.~{LDAC}
SPI1_MISO: R13.1 ; port DAC.MISO
SPI1_MOSI: R15.2 ; port DAC.MOSI
SPI1_nCS: R15.3 ; port DAC.~{CS}
SPI1_nRST: R15.1 ; port DAC.~{RST}
SPI1_SCLK: R15.4 ; port DAC.SCLK
NetC5_1: C5.1 R5.1 R6.1 U1.2(IN-)
NetC6_2: C6.2 R7.1 R8.2 U1.3(IN+)
NetC10_1: C10.1 R9.1 R10.1 U1.6(IN-)
NetC11_2: C11.2 R12.1 R14.2 U1.5(IN+)
NetC12_1: C12.1 R16.1 R17.1 U1.9(IN-)
NetC13_2: C13.2 R18.1 R19.2 U1.10(IN+)
NetC14_1: C14.1 R20.1 R21.1 U1.13(IN-)
NetC15_2: C15.2 R22.1 R23.2 U1.12(IN+)
NetR6_2: R6.2 U2.5(VOUTD)
NetR10_2: R10.2 U2.4(VOUTC)
NetR11_1: R11.1 R15.8 U2.13(~{RST})
NetR13_7: R13.7 U2.7(~{LDAC})
NetR13_8: R13.8 U2.6(SDO)
NetR15_5: R15.5 U2.10(SCLK)
NetR15_6: R15.6 U2.11(~{SYNC})
NetR15_7: R15.7 U2.12(SDIN)
NetR17_2: R17.2 U2.1(VOUTA)
NetR21_2: R21.2 U2.16(VOUTB)

Not connected (* = marked no-connect by the designer): R13 3* 4* 5* 6*

### Notes on the sheet
- Analog ouputs
- Power supply decoupling for U1
- Aout = @{"Id":"QIRFHAXQ\BIRYAAHR"} / @{"Id":"QIRFHAXQ\GPNTABEF"} *(Vref-Vin)
  = 2*(Vref-Vin)
- Analog full scale output range is -5V to 5V
  Output current is max 25mA
- Operational amplifiers are inverting. The correction of sign is made by software. The polarity is the very same as in B-Box RCP.
- (near P9) Analog Outputs
- DAC0 to DAC3
- WARNING: The channels are crossed here the same way as in B-Box (for optimal compatibility), i.e.:
  A -> DAC1
  B -> DAC0
  C -> DAC2
  D -> DAC3
- Title:
- Imperix Ltd
- Route des Ronquos 23
- Author:
- Project:
- Size:
- A3
- Date:
- Time:
- Revision:
- Sheet
- of
- 1950 Sion
- Switzerland
- +41 27 552 06 60
- dev@imperix.ch
- Revised by:
- File:

### Library data of the parts
C1 C3 C9 = CMP-055-000003-7: as C56 on sheet Power; Tolerance: 10%; Dielectric: X5R; Voltage Rating (DC): 10V; Case/Package: 0603
C2 C4 C7 C8 = CMP-004-000006-18: as C57 on sheet Power; Tolerance: 10%; Case/Package: 0402; Dielectric: X7R; Voltage Rating (DC): 25V
C5 C10 C12 C14 = CMP-027-000004-13: CAP CER 56PF 50V C0G 0402 1% (Generic Imperix Component); Tolerance: 1%; Case/Package: 0402; Voltage Rating (DC): 50V
C6 C11 C13 C15 = CMP-012-000001-12: CAP CER 10NF 25V X7R 0402 10% (Generic Imperix Component); Tolerance: 10%; Case/Package: 0402; Voltage Rating (DC): 25V; Dielectric: X7R
P9 = CMP-003-000046-13: Conn PC Terminal Block 5 POS 3.5mm Solder Thru-Hole 17.5A; Number of Poles: 5; Voltage: 300V; Current: 10A; Approvals: UL,EAC; Number of Levels: 1; Wire Gauge (Max): 26AWG; Gender: Male; Wire Gauge (Min): 16AWG; Voltage Rating: 160V; Number of Rows: 1; Mounting Technology: Through Hole; Lead Free: Lead Free; Color: Green; Number of Positions: 5; Orientation: Straight; Weight: 0.086068oz; Max Current Rating: 17.5A; Number of Circuits: 5; Number of Positions Per Level: 5; Packaging: Bulk; Pitch: 3.5mm; Current Rating: 17.5A; Material: Polyamide; Series: COMBICON PTA; Length: 11.2mm; Pins: 5; Height: 13.7mm; Housing Material: Nylon; Number of Contacts: 5; Contact Material: Tin; RoHS Compliant: Yes; Width: 17.5mm; Depth: 9.9mm; Housing Color: Green; Package Quantity: 100; Termination: Screw; Flammability Rating: UL94 V-0
R5 R8 R9 R11 R14 R16 R19 R20 R23 = CMP-009-000034-6: RES SMD 6.19KΩ 1/16W 100PPM 0402 1% (Generic Imperix Component); Temperature Coefficient: 100ppm/°C; Power Rating: 1/16W; Case/Package: 0402
  R11: Tolerance: 1%
R6 R7 R10 R12 R17 R18 R21 R22 = CMP-00012-1: RES SMD 3.09KΩ 1/16W 100PPM 0402 1% (Generic Imperix Component); Temperature Coefficient: 100ppm/°C; Power Rating: 1/16W; Case/Package: 0402
R13 R15 R70 = CMP-009-000035-3: Res Thick Film Array 33 Ohm 5% ±200ppm/°C ISOL 8-Pin 0804(4 X 0402) Convex SMD Automotive T/R; Power Rating: 62.5mW; Voltage Rating (DC): 100V; Circuit Type: Isolated; Power Dissipation: 63mW; Number of Elements: 4; Number of Contacts: 8; Voltage Rating: 50V; Tolerance: 5%; Pins: 8; Resistance Tolerance: 5%; Series: EXB; Min Operating Temperature: -55°C; Height: 0.35mm; Temperature Coefficient: 200ppm/°C; Length: 2mm; Package Quantity: 10000; Width: 1mm; Reach SVHC Compliant: No; Power Per Element: 62.5mW; Technology: THICK FILM; Termination: Convex; RoHS Compliant: Yes; Packaging: Tape and Reel; Case Code (Metric): 1005; Max Operating Temperature: 125°C; Lead Free: Lead Free; Case/Package: 0804; Mounting Technology: Surface Mount; Radiation Hardening: No; Military Standard: Not; Number of Resistors: 4; Depth: 1mm; Case Code (Imperial): 0402; Terminal Pitch: 0.5mm
TP101-TP105 = CMP-049-000000-14: Black PC Test Point, Miniature Phosphor Bronze Silver Plating Through Hole Mounting Type; Hole Diameter: 1.6mm; Inside Diameter: 1.27mm; Outside Diameter: 2.54mm; Number of Contacts: 1; Insulation: Insulated; Body Material: Bronze; Color: Black; Contact Material: Bronze; Contact Plating: Tin,Silver; Lead Free: Lead Free; Length: 7.62mm; Material: Nylon,Bronze,Silver; Mounting Technology: Through Hole; Package Quantity: 100; Packaging: Bulk; Reach SVHC Compliant: No; RoHS Compliant: Yes; Series: THM; Insulation Material: Nylon; Housing Color: Black; Orientation: Straight; Diameter: 2.54mm; Termination: Through Hole; Number of Ports: 1; Plating: Silver
U1 = CMP-00166-1: Precision Amplifiers Low-power low-noise four-channel precision amplifier with e-trim and super-beta inputs; Number of Channels: 4; Operating Supply Current: 0.24mA; Gain Bandwidth Product: 3.6MHz; Input Offset Voltage (Vos): 2uV; Input Bias Current: 100pA; Slew Rate: 4V/µs; Max Operating Temperature: 85°C; Pins: 14; Number of Circuits: 4; Packaging: Tape and Reel; Mounting Technology: Surface Mount; Case/Package: TSSOP-14; RoHS Compliant: Yes; Min Operating Temperature: -40°C
U2 = CMP-029-000000-12: DAC 4-CH Resistor-String 14-bit 16-Pin LFCSP EP T/R; Supply Type: Analog,Digital; Settling Time: 5us; Number of Converters: 4; Min Output Voltage: 2.7V; Min Input Voltage: 750mV; Sampling Rate: 25MS/s; Signal to Noise Ratio (SNR): 90dB; Power Dissipation: 7.15mW; Output Type: Voltage; Differential Output: No; Max Output Voltage: 5.5V; Supply Current: 1.1mA; Output Polarity: Unipolar; Integral Nonlinearity (INL): 1LSB; Interface: SPI,Serial; Resolution: 14b; Number of Bits: 14; Slew Rate: 0.8V/µs; Reach SVHC Compliant: No; Case/Package: QFN-16; Min Operating Temperature: -40°C; Series: nanoDAC+™; Contact Plating: Tin,Matte; Max Operating Temperature: 105°C; Min Supply Voltage: 2.7V; Number of DAC Channels: 4; Max Supply Voltage: 5.5V; RoHS Compliant: Yes; Package Quantity: 1500; Packaging: Tape and Reel; Lead Free: Contains Lead; Pins: 16; Number of D/A Converters: 4; Conversion Rate: 25MS/s